# Altium schematic sheet MVM_PSU.SchDoc: Title
size 420 x 297 mm; Author: G.Kasprowicz; CompanyName: WUT ISE; DrawnBy: G.Kasprowicz; Organization: WUT ISE; Address1: PW ISE; Address2: Nowowiejska 15/19 00-665 Warsaw; Address3: gkasprow@gmail.com; Revision: 2; SheetNumber: -; SheetTotal: -; ModifiedBy: -; CheckedDate: -; Title2: Title 2; DivGrp: WUT ISE; Designer: G.Kasprowicz; ModifiedDate: -; ProjectName: Sensor Box
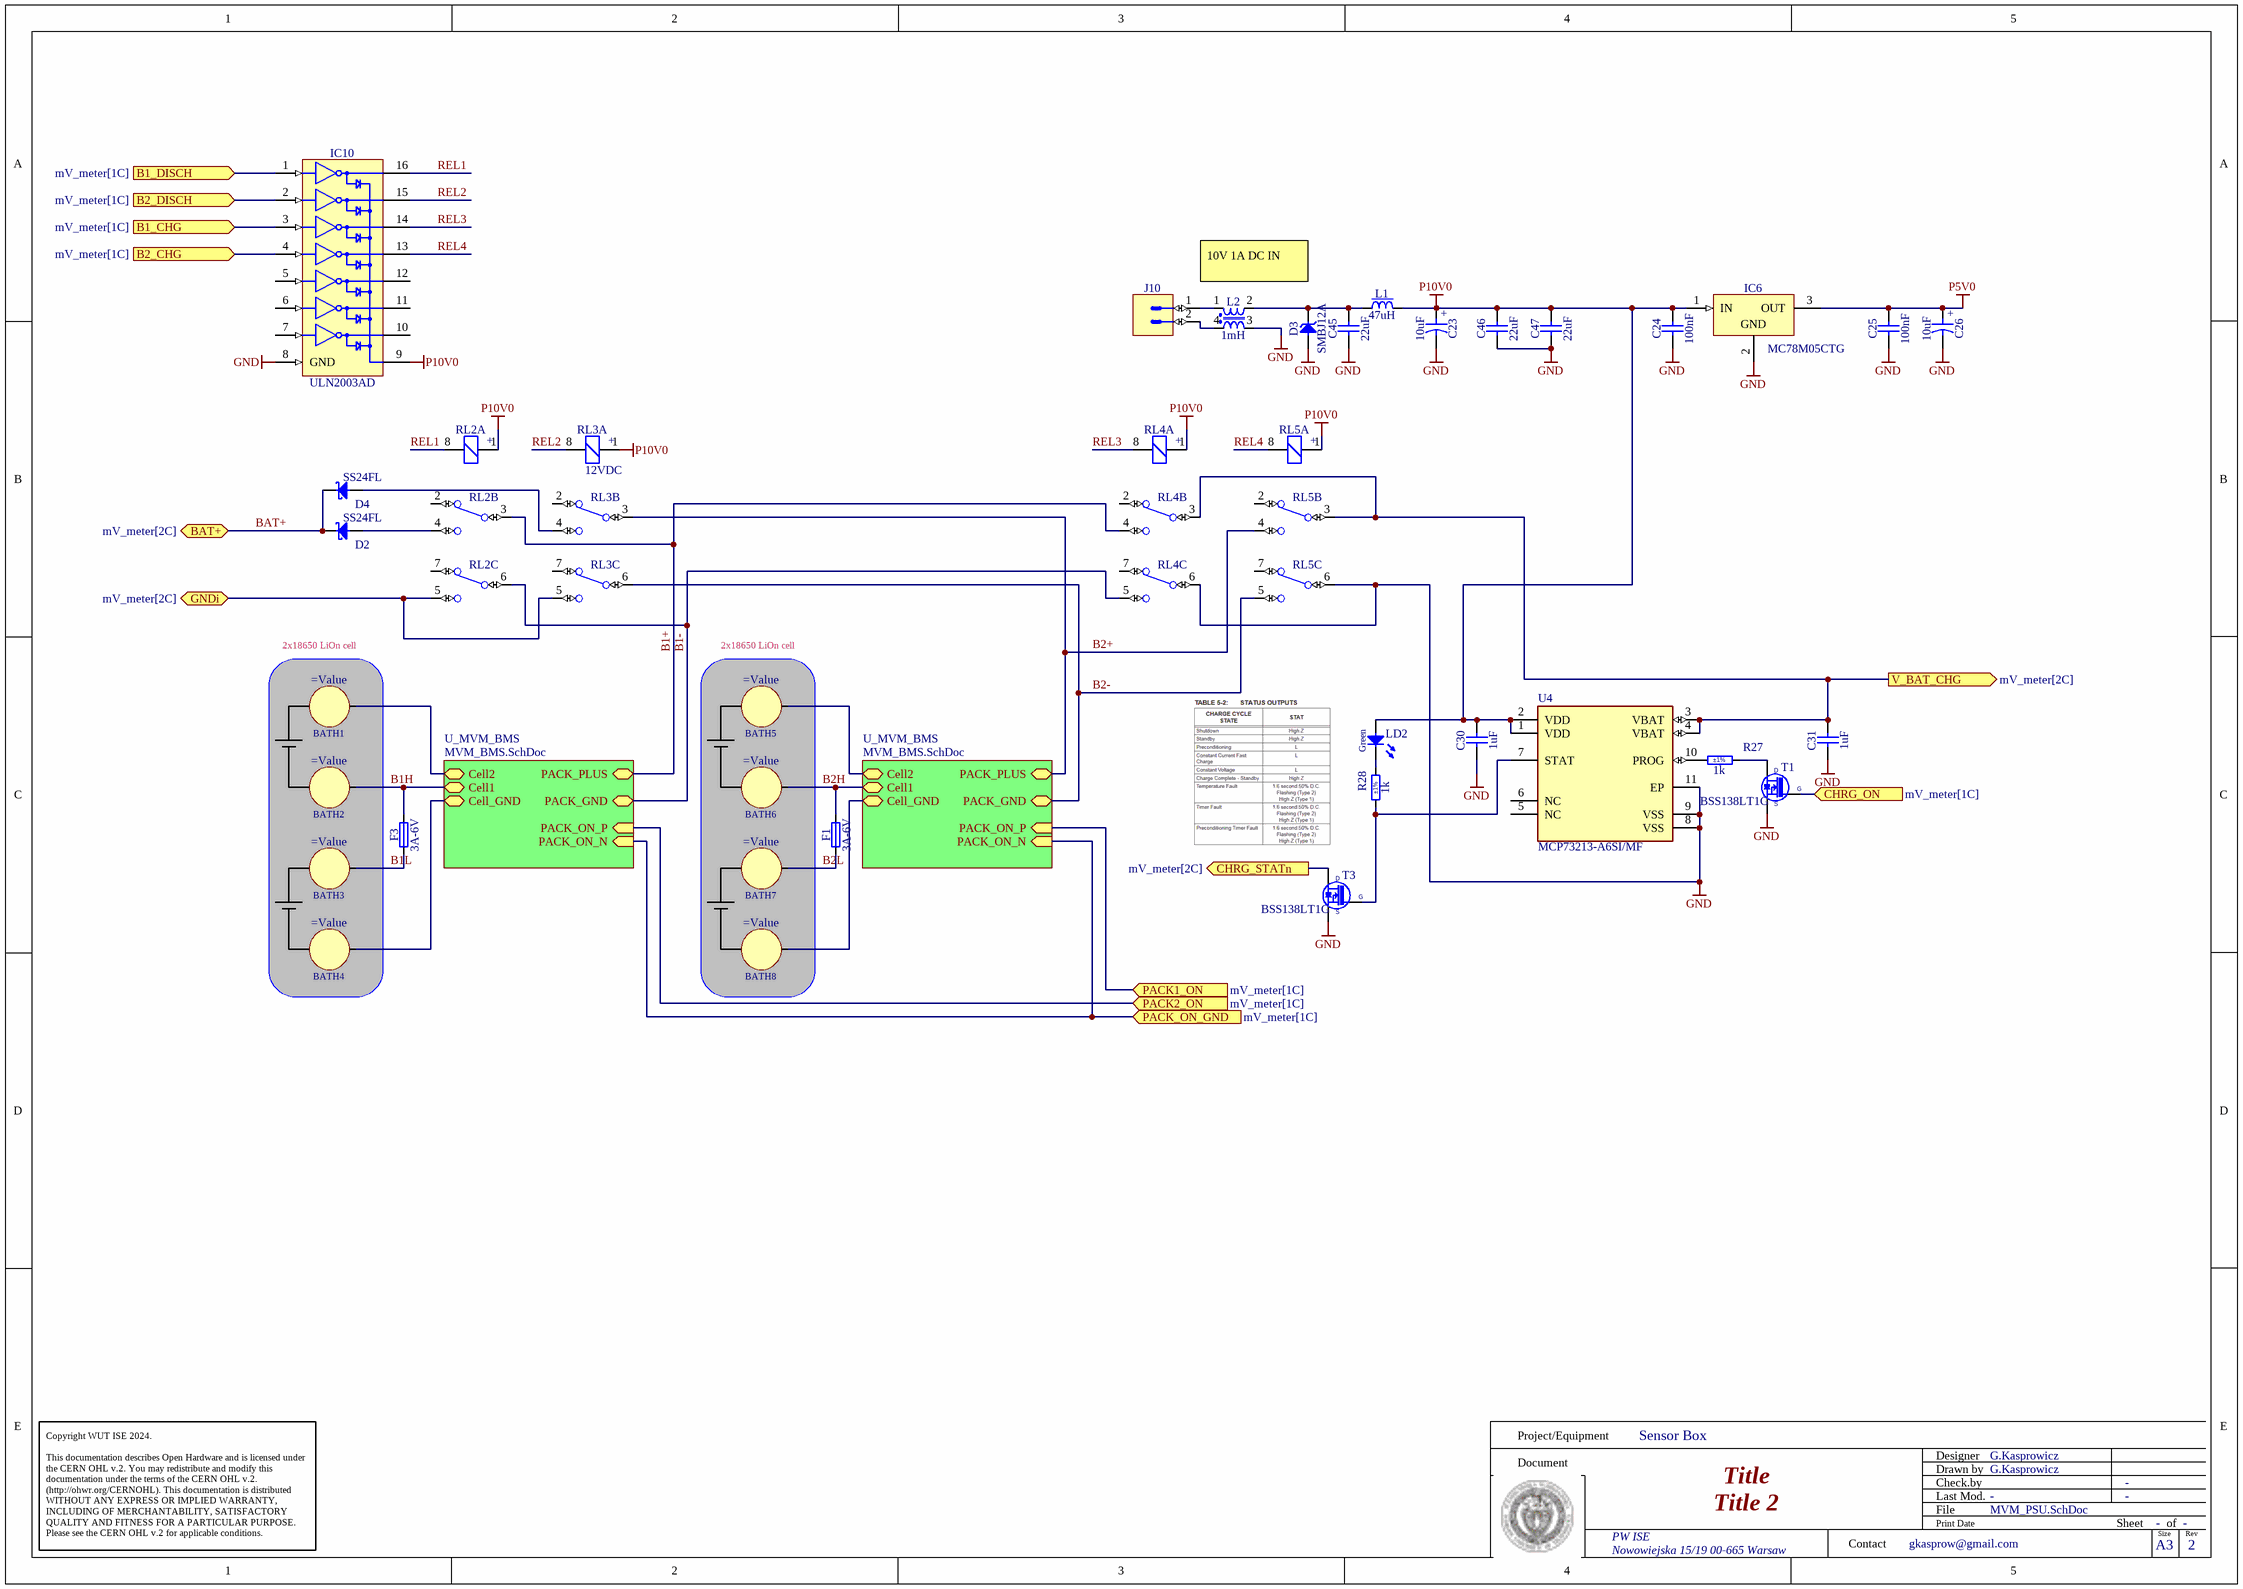
[diagram p0: MVM_PSU.SchDoc]

## Parts
BATH1  (no value)  [BATH_KEYSTONE_54]
BATH2  (no value)  [BATH_KEYSTONE_54]
BATH3  (no value)  [BATH_KEYSTONE_54]
BATH4  (no value)  [BATH_KEYSTONE_54]
BATH5  (no value)  [BATH_KEYSTONE_54]
BATH6  (no value)  [BATH_KEYSTONE_54]
BATH7  (no value)  [BATH_KEYSTONE_54]
BATH8  (no value)  [BATH_KEYSTONE_54]
C23  10uF  [CAPMP3216X180N]
C24  100nF  [CAPC2012X88N]
C25  100nF  [CAPC2012X88N]
C26  10uF  [CAPMP3216X180N]
C30  1uF  [CAPC1608X87N]
C31  1uF  [CAPC1608X87N]
C45  22uF  [CAPC3216X180N]
C46  22uF  [CAPC3216X180N]
C47  22uF  [CAPC3216X180N]
D2  SS24FL  [SODFL3617X108N]
D3  SMBJ12A  [DIOM5336X265N]
D4  SS24FL  [SODFL3617X108N]
F1  3A-6V  [FUSR_BOURNS_MF-SM300]
F3  3A-6V  [FUSR_BOURNS_MF-SM300]
IC6  MC78M05CTG  [TO-220-V]
IC10  ULN2003AD  [SOIC127P600X175-16N]
J10  (no value)  [PHOENIX_1803277]
L1  47uH  [IND_WURTH_WE-LHMI_7050]
L2  1mH  [IND_BOURNS_SRF1006]
LD2  Green  [LED_AVAGO_HSME-C110]
R27  1k  Tolerance: ±1%  [RESC1608X55N]
R28  1k  Tolerance: ±1%  [RESC1608X55N]
RL2  REL_TYCO_IM Non-latching  [REL_TYCO_IMXXXGX]  (value not drawn)  (parts A,B,C of 3)
RL3  value 12VDC  [REL_TYCO_IMXXXGX]  (hidden comment: REL_TYCO_IM Non-latching)  (parts A,B,C of 3)
RL4  REL_TYCO_IM Non-latching  [REL_TYCO_IMXXXGX]  (value not drawn)  (parts A,B,C of 3)
RL5  REL_TYCO_IM Non-latching  [REL_TYCO_IMXXXGX]  (value not drawn)  (parts A,B,C of 3)
T1  BSS138LT1G  [SOT95P240X110-3N]
T3  BSS138LT1G  [SOT95P240X110-3N]
U4  MCP73213-A6SI/MF  [FP-C04-063-IPC_B]

## Blocks framed on the sheet
2x18650 LiOn cell: BATH1-BATH4
2x18650 LiOn cell: BATH5-BATH8

## Sub-sheets
U_MVM_BMS = MVM_BMS.SchDoc: Cell1 (bidir), Cell2 (bidir), Cell_GND (bidir), PACK_GND (bidir), PACK_PLUS (bidir), PACK_ON_P (in), PACK_ON_N (in)
U_MVM_BMS = MVM_BMS.SchDoc: Cell1 (bidir), Cell2 (bidir), Cell_GND (bidir), PACK_GND (bidir), PACK_PLUS (bidir), PACK_ON_P (in), PACK_ON_N (in)

## Ports
B1_CHG (in, see mV_meter[1C]), B1_DISCH (in, see mV_meter[1C]), B2_CHG (in, see mV_meter[1C]), B2_DISCH (in, see mV_meter[1C]), BAT+ (bidir, see mV_meter[2C]), CHRG_ON (in, see mV_meter[1C]), CHRG_STATn (out, see mV_meter[2C]), GNDi (bidir, see mV_meter[2C]), PACK1_ON (in, see mV_meter[1C]), PACK2_ON (in, see mV_meter[1C]), PACK_ON_GND (in, see mV_meter[1C]), V_BAT_CHG (out, see mV_meter[2C])

## Nets
GND: C23.2 C24.1 C25.1 C26.2 C30.1 C31.1 C45.1 C46.1 C47.1 D3.2(A) IC6.2(GND) IC10.8(GND) L2.3 RL4.6(C) RL5.6(C) T1.2(S) T3.2(S) U4.8(VSS) U4.9(VSS) U4.11(EP)
P5V0: C25.2 C26.1 IC6.3(OUT)
P10V0: C23.1 C24.2 C30.2 C46.2 C47.2 IC6.1(IN) IC10.9(COM) L1.2 LD2.2(A) RL2.1 RL3.1 RL4.1 RL5.1 U4.1(VDD) U4.2(VDD)
B1+: RL2.3(C) RL4.4(NO) ; sheet U_MVM_BMS/PACK_PLUS
B1-: RL2.6(C) RL4.5(NO) ; sheet U_MVM_BMS/PACK_GND
B1_CHG: IC10.3(IN3) ; port B1_CHG
B1_DISCH: IC10.1(IN1) ; port B1_DISCH
B1H: BATH2.1(PLUS) F3.2 ; sheet U_MVM_BMS/Cell1
B1L: BATH3.1(PLUS) F3.1
B2+: RL3.3(C) RL5.4(NO) ; sheet U_MVM_BMS/PACK_PLUS
B2-: RL3.6(C) RL5.5(NO) ; sheet U_MVM_BMS/PACK_GND
B2_CHG: IC10.4(IN4) ; port B2_CHG
B2_DISCH: IC10.2(IN2) ; port B2_DISCH
B2H: BATH6.1(PLUS) F1.2 ; sheet U_MVM_BMS/Cell1
B2L: BATH7.1(PLUS) F1.1
BAT+: D2.1(C) D4.1(C) ; port BAT+
CHRG_ON: T1.1(G) ; port CHRG_ON
CHRG_STATn: T3.3(D) ; port CHRG_STATn
GNDi: RL2.5(NO) RL3.5(NO) ; port GNDi
PACK1_ON: port PACK1_ON, sheet U_MVM_BMS/PACK_ON_P
PACK2_ON: port PACK2_ON, sheet U_MVM_BMS/PACK_ON_P
PACK_ON_GND: port PACK_ON_GND, sheet U_MVM_BMS/PACK_ON_N, sheet U_MVM_BMS/PACK_ON_N
REL1: IC10.16(OUT1) RL2.8
REL2: IC10.15(OUT2) RL3.8
REL3: IC10.14(OUT3) RL4.8
REL4: IC10.13(OUT4) RL5.8
V_BAT_CHG: C31.2 RL4.3(C) RL5.3(C) U4.3(VBAT) U4.4(VBAT) ; port V_BAT_CHG
NetBATH1_1: BATH1.1(PLUS) ; sheet U_MVM_BMS/Cell2
NetBATH4_1: BATH4.1(PLUS) ; sheet U_MVM_BMS/Cell_GND
NetBATH5_1: BATH5.1(PLUS) ; sheet U_MVM_BMS/Cell2
NetBATH8_1: BATH8.1(PLUS) ; sheet U_MVM_BMS/Cell_GND
NetC45_2: C45.2 D3.1(C) L1.1 L2.2
NetD2_2: D2.2(A) RL2.4(NO)
NetD4_2: D4.2(A) RL3.4(NO)
NetJ10_1: J10.1 L2.1
NetJ10_2: J10.2 L2.4
NetLD2_1: LD2.1(C) R28.2
NetR27_1: R27.1 U4.10(PROG)
NetR27_2: R27.2 T1.3(D)
NetR28_1: R28.1 T3.1(G) U4.7(STAT)

Not connected (* = marked no-connect by the designer): IC10 5(IN5) 6(IN6) 7(IN7) 10(OUT7) 11(OUT6) 12(OUT5); RL2 2(NC) 7(NC); RL3 2(NC) 7(NC); RL4 2(NC) 7(NC); RL5 2(NC) 7(NC); U4 5(NC) 6(NC)

## Notes on the sheet
- 10V 1A DC IN
- Project/Equipment
- Document
- Designer
- Drawn by
- Check.by
- Copyright WUT ISE 2024.
  This documentation describes Open Hardware and is licensed under the CERN OHL v.2. You may redistribute and modify this documentation under the terms of the CERN OHL v.2. (http://ohwr.org/CERNOHL). This documentation is distributed WITHOUT ANY EXPRESS OR IMPLIED WARRANTY, INCLUDING OF MERCHANTABILITY, SATISFACTORY QUALITY AND FITNESS FOR A PARTICULAR PURPOSE. Please see the CERN OHL v.2 for applicable conditions.
- Contact
- File
- Last Mod.
- Print Date
- Sheet
- Size
- A3
- of
- Rev
- (in symbol CTE3216-18_10UF_10V_10%_LESR1800) +
- (in symbol REL_TYCO_IM06CGR, part A) +

## Library data of the parts
BATH1-BATH8 = BATH_KEYSTONE_54: Battery Holder whit 1 Pin; Part Description: Clip for 16mm - 19mm Diameter Battery; Manufacturer Part Number: 54; PressFit: No; Part Number: BATH_KEYSTONE_54; Component Kind: Standard; Component Type: Standard; Pin Count: 1; PackageDescription: Clip for 16mm - 19mm Diameter Battery; Family: Battery; Mounted: Yes; Socket: No; SMD: No; Sense: No; Manufacturer: KEYSTONE; ComponentHeight: 16.59mm; HelpURL: \\cern.ch\dfs\Applications\Altium\Datasheets\BATH_KEYSTONE_54.pdf; Author: CERN DEM JLC; CreateDate: 21.03.2018; LatestRevisionDate: 21.03.2018
C23 C26 = CTE3216-18_10UF_10V_10%_LESR1800: Polarised capacitor; Part Description: Low ESR 1R8 Solid Tantalum Chip Capacitor; Manufacturer: GENERIC; Manufacturer1 Part Number: TPSA106K010R1800; Voltage: 10V; Tolerance: ±10%; Part Number: CTE3216-18_10UF_10V_10%_LESR1800; Component Kind: Standard; Component Type: Standard; Pin Count: 2; Value: 10uF; Status: Preferred; Manufacturer Part Number: CTE3216-18_10UF_10V_10%_LESR1800; Case: A; Mounted: Yes; Socket: No; SMD: Yes; Sense: No; Manufacturer1 Example: AVX; Manufacturer1 ComponentHeight: 1.8mm; HelpURL: \\cern.ch\dfs\Applications\Altium\Datasheets\CTE-LESR_AVX_TPS.pdf; Author: CERN DEM JLC; CreateDate: 05.05.2008; LatestRevisionDate: 20.01.2009
C24 C25 = CC0805_100NF_50V_1%_NP0: Non-polarised capacitor; Part Description: SMD Multilayer Chip Ceramic Capacitor; Manufacturer: GENERIC; Manufacturer1 Part Number: 0805N103F500C; Voltage: 50V; TC: C0G/NP0; Tolerance: ±1%; Part Number: CC0805_100NF_50V_1%_NP0; Component Kind: Standard; Component Type: Standard; Footprint: CAPC2012X135N; Pin Count: 2; Value: 100nF; Status: Not Recommended; Manufacturer Part Number: CC0805_100NF_50V_1%_NP0; Case: 0805; Mounted: Yes; Socket: No; SMD: Yes; Sense: No; ComponentHeight: 1.35mm; Manufacturer1 Example: WALSIN TECHNOLOGY CORPORATION; Manufacturer1 ComponentHeight: 1.35mm; HelpURL: \\cern.ch\dfs\Applications\Altium\Datasheets\CC0805_WALSIN_0805.pdf; Author: CERN DEM HF; CreateDate: 28.08.2023; LatestRevisionDate: 28.08.2023
C30 C31 = CC0603_1UF_16V_10%_X7R: Non-polarised capacitor; Part Description: SMD Multilayer Chip Ceramic Capacitor; Manufacturer: GENERIC; Manufacturer1 Part Number: 223878615663; Voltage: 16V; TC: X7R; Tolerance: ±10%; Part Number: CC0603_1UF_16V_10%_X7R; Component Kind: Standard; Component Type: Standard; Pin Count: 2; Value: 1uF; Status: None; Manufacturer Part Number: CC0603_1UF_16V_10%_X7R; Case: 0603; Mounted: Yes; Socket: No; SMD: Yes; Sense: No; Manufacturer1 Example: YAGEO PHYCOMP; Manufacturer1 ComponentHeight: 0.9mm; HelpURL: \\cern.ch\dfs\Applications\Altium\Datasheets\CC0603_X7R_PHYCOMP.pdf; Author: CERN DEM JLC; CreateDate: 03.12.2007; LatestRevisionDate: 17.04.2015
C45-C47 = CC1206_22UF_10V_10%_X7R: Non-polarised capacitor; Part Description: SMD Multilayer Chip Ceramic Capacitor; Manufacturer: GENERIC; Manufacturer1 Part Number: GRM31CR71A226KE15L; Voltage: 10V; TC: X7R; Tolerance: ±10%; Part Number: CC1206_22UF_10V_10%_X7R; Component Kind: Standard; Component Type: Standard; Pin Count: 2; Value: 22uF; Status: Preferred; Manufacturer Part Number: CC1206_22UF_10V_10%_X7R; Case: 1206; Mounted: Yes; Socket: No; SMD: Yes; Sense: No; Manufacturer1 Example: MURATA; Manufacturer1 ComponentHeight: 1.8mm; HelpURL: \\cern.ch\dfs\Applications\Altium\Datasheets\CC1206_X7R_MURATA_GRM-HI-CAP.pdf; Author: CERN DEM JLC; CreateDate: 08.06.2010; LatestRevisionDate: 08.06.2010
D2 D4 = SS24FL: Schottky Diode; Part Description: Surface Mount Schottky Barrier Rectifier; Manufacturer: ON SEMICONDUCTOR; Voltage: 40V; Power: 2A; PressFit: No; Bonding: No; Part Number: SS24FL; Component Kind: Standard; Component Type: Standard; Device: SS24FL; PackageDescription: SODFL Diode (SOD123FL); 2.75mm W X 1.72mm L X 1.08mm H body, IPC Medium Density; Manufacturer Part Number: SS24FL; Pin Count: 2; Case: SOD-123FL; Mounted: Yes; Socket: No; SMD: Yes; Sense: No; ComponentHeight: 1.08mm; HelpURL: \\cern.ch\dfs\Applications\Altium\Datasheets\SS24FL.pdf; Author: CERN DEM BC; CreateDate: 06.10.2020; LatestRevisionDate: 06.10.2020
D3 = SMBJ12A: Zener Diode; Part Description: Uni-Directional Transient Voltage Suppressor Diode; Manufacturer: FAIRCHILD SEMICONDUCTOR; Voltage: 12V; Power: 600W; PressFit: No; Bonding: No; Part Number: SMBJ12A; Component Kind: Standard; Component Type: Standard; Device: SMBJ12A; PackageDescription: DO-214-AA/SMB Diode, Molded Body; 5.34mm L X 3.625mm W X 2.65mm H, IPC Medium Density; Manufacturer Part Number: SMBJ12A; Pin Count: 2; Case: DO-214AA; Mounted: Yes; Socket: No; SMD: Yes; Sense: No; ComponentHeight: 2.65mm; HelpURL: \\cern.ch\dfs\Applications\Altium\Datasheets\SMBJ.pdf; Author: CERN DEM JLC; CreateDate: 10.04.2013; LatestRevisionDate: 10.04.2013
F1 F3 = FUSR_BOURNS_MF-SM300-2: Fuse; Part Description: PTC Resettable Fuse; Manufacturer: BOURNS; PressFit: No; Part Number: FUSR_BOURNS_MF-SM300-2; Component Kind: Standard; Component Type: Standard; Pin Count: 2; PackageDescription: PolySwitch, 2-Leads, Body 7.35x5.12mm Nominal; Family: Fuses Resettable; Mounted: Yes; Socket: No; SMD: Yes; Sense: No; Value: 3A-6V; Manufacturer Part Number: MF-SM300-2; ComponentHeight: 3mm; HelpURL: \\cern.ch\dfs\Applications\Altium\Datasheets\FUSR_BOURNS_MF-SM300-2.pdf; Author: CERN DEM JLC; CreateDate: 15.08.2013; LatestRevisionDate: 15.08.2013
IC6 = MC78M05CTG_v: 3-Terminal Regulator 1=IN 2=GND 3=OUT; Part Description: 3-Terminal 5V 500mA Positive Voltage Regulator; Manufacturer: ON SEMICONDUCTOR; PressFit: No; Bonding: No; Part Number: MC78M05CTG_v; Component Kind: Standard; Component Type: Standard; Device: MC78M05CTG; PackageDescription: TO-220 3-Terminal - Vertical Mount; Manufacturer Part Number: MC78M05CT; Pin Count: 4; Case: TO-220; Mounted: Yes; Socket: No; SMD: No; Sense: No; ComponentHeight: 19.68mm; HelpURL: \\cern.ch\dfs\Applications\Altium\Datasheets\MC78M05CTG.pdf; Author: CERN DEM JLC; CreateDate: 08.03.2018; LatestRevisionDate: 24.05.2022
IC10 = ULN2003AD: High-Voltage High-Current Darlington Array; Manufacturer: TEXAS INSTRUMENTS; PressFit: No; Bonding: No; Part Number: ULN2003AD; Component Kind: Standard; Component Type: Standard; Device: ULN2003AD; PackageDescription: SOIC 16, Pitch 1.27mm - Body 4x10mm, IPC Medium Density; Part Description: High-Voltage High-Current Darlington Array; Manufacturer Part Number: ULN2003AD; Pin Count: 16; Case: SOIC16; Mounted: Yes; Socket: No; SMD: Yes; Sense: No; ComponentHeight: 1.75mm; Author: CERN DEM JLC; HelpURL: \\cern.ch\dfs\Applications\Altium\Datasheets\ULN2003AD.pdf; CreateDate: 04.08.2009; LatestRevisionDate: 04.08.2009
J10 = PHOENIX_1803277: Connector 2 Male; Part Description: 8A 160 V, Pitch: 3.81mm, 2 Positions  Right Angled Header; Manufacturer: PHOENIX CONTACT; Manufacturer Part Number: 1803277 (MC 1,5/ 2-G-3,81); PressFit: No; Part Number: PHOENIX_1803277; Component Kind: Standard; Component Type: Standard; Pin Count: 2; Mounted: Yes; Socket: No; SMD: No; Sense: No; Status: None; ComponentHeight: 7.25mm; HelpURL: \\cern.ch\dfs\Applications\Altium\Datasheets\PHOENIX_1803277.pdf; Author: CERN DEM JLC; CreateDate: 06.05.2014; LatestRevisionDate: 06.05.2014
L1 = IND_47UH_20%_WURTH_WE-LHMI_74437349470: Inductor With Core; Part Description: SMD Power Inductor (WE-LHMI Series); Manufacturer: WURTH ELEKTRONIK; Power: 1.45A; Resistance: 0.290R; Tolerance: ±20%; Part Number: IND_47UH_20%_WURTH_WE-LHMI_74437349470; Component Kind: Standard; Component Type: Standard; Pin Count: 2; Value: 47uH; Manufacturer Part Number: 74437349470; Mounted: Yes; Socket: No; SMD: Yes; Sense: No; ComponentHeight: 5mm; HelpURL: \\cern.ch\dfs\Applications\Altium\Datasheets\IND_WURTH_WE-LHMI_74437349470.pdf; Author: CERN DEM HF; CreateDate: 22.11.2023; LatestRevisionDate: 22.11.2023
L2 = IND_1MH_40%_BOURNS_SRF1006: Inductor Common Mode; Part Description: Line Filter, Common Mode Choke; Manufacturer: BOURNS; Manufacturer Part Number: SRF1006-102Y; Power: 0.95A; Resistance: 0.180R; Tolerance: ±40%; Part Number: IND_1MH_40%_BOURNS_SRF1006; Component Kind: Standard; Component Type: Standard; Pin Count: 2; Value: 1mH; Mounted: Yes; Socket: No; SMD: Yes; Sense: No; ComponentHeight: 6.5mm; HelpURL: \\cern.ch\dfs\Applications\Altium\Datasheets\IND_BOURNS_SRF1006.pdf; Author: CERN DEM HF; CreateDate: 30.01.2024; LatestRevisionDate: 30.01.2024
LD2 = LED_AVAGO_HSME-C110: LED Green 1C 2A; Part Description: High Performance Right Angle Chip Green LED; Manufacturer: AVAGO TECHNOLOGIES; PressFit: No; Bonding: No; Part Number: LED_AVAGO_HSME-C110; Component Kind: Standard; Component Type: Standard; Color: Green; PackageDescription: Green Chip LED, 2-Leads, Body 3.3x1.6mm, Side Emitting Package; Manufacturer Part Number: HSME-C110; Pin Count: 2; Case: 1206; Mounted: Yes; Socket: No; SMD: Yes; Sense: No; ComponentHeight: 1.1mm; HelpURL: \\cern.ch\dfs\Applications\Altium\Datasheets\LED_AVAGO_HSME-C110.pdf; ComponentLink1URL: \\cern.ch\dfs\Applications\Altium\Datasheets\LED_AVAGO_HSME-C110_DESIGN-GUIDE.pdf; ComponentLink1Description: Design Guide; Author: CERN DEM JMW; CreateDate: 30.07.2009; LatestRevisionDate: 20.06.2012
R27 R28 = R0603_1K_1%_0.1W_100PPM: Resistor - 1%; Part Description: General Purpose Thick Film Chip Resistor; Manufacturer: GENERIC; Manufacturer1 Part Number: NRC06F1001TRF; Power: 0.1W; TC: ±100ppm/°C; PressFit: No; Part Number: R0603_1K_1%_0.1W_100PPM; Component Kind: Standard; Component Type: Standard; Pin Count: 2; Value: 1k; Status: Preferred; Manufacturer Part Number: R0603_1K_1%_0.1W_100PPM; Case: 0603; Mounted: Yes; Sense: No; Socket: No; SMD: Yes; Manufacturer1 Example: NIC COMPONENT; Manufacturer1 ComponentHeight: 0.55mm; HelpURL: \\cern.ch\dfs\Applications\Altium\Datasheets\R0603_NIC_NRC.pdf; Author: CERN DEM JLC; CreateDate: 03.12.2007; LatestRevisionDate: 13.03.2008
RL2 RL4 RL5 = REL_TYCO_IM06CGR: IM Signal Relay (Monostable 1 Coil Non-latching); Part Description: 2A/250VAC, DPDT  (2 Form C) SMT High Dielectric Signal Relay, IM Series; Manufacturer: TYCO AXICOM; Manufacturer Part Number: IM06CGR or 9-1462037-9; PressFit: No; Value: 12VDC; Sense Comment: Cleaning Limitation; Status Comment: Sensitive (See Sensitive Field); Part Number: REL_TYCO_IM06CGR; Component Kind: Standard; Component Type: Standard; Pin Count: 8; PackageDescription: 8 Gull Wings Leads SMT Relay, IM Series, Body 10mm x 6mm; Mounted: Yes; Socket: No; SMD: Yes; Sense: Yes; Status: Not Recommended; ComponentHeight: 5.65mm; HelpURL: \\cern.ch\dfs\Applications\Altium\Datasheets\REL_TYCO_IM06CGR.pdf; Author: CERN DEM JLC; CreateDate: 04.12.2013; LatestRevisionDate: 04.12.2013
RL3 = REL_TYCO_IM06CGR: IM Signal Relay (Monostable 1 Coil Non-latching); Part Description: 2A/250VAC, DPDT  (2 Form C) SMT High Dielectric Signal Relay, IM Series; Manufacturer: TYCO AXICOM; Manufacturer Part Number: IM06CGR or 9-1462037-9; PressFit: No; Sense Comment: Cleaning Limitation; Status Comment: Sensitive (See Sensitive Field); Part Number: REL_TYCO_IM06CGR; Component Kind: Standard; Component Type: Standard; Pin Count: 8; PackageDescription: 8 Gull Wings Leads SMT Relay, IM Series, Body 10mm x 6mm; Mounted: Yes; Socket: No; SMD: Yes; Sense: Yes; Status: Not Recommended; ComponentHeight: 5.65mm; HelpURL: \\cern.ch\dfs\Applications\Altium\Datasheets\REL_TYCO_IM06CGR.pdf; Author: CERN DEM JLC; CreateDate: 04.12.2013; LatestRevisionDate: 04.12.2013
T1 T3 = BSS138LT1G: N-CHANNEL MOSFET WITH DIODE; Part Description: 50V, 200mA N-Channel Enhancement Mode Field-Effect Transistor; Manufacturer: ON SEMICONDUCTOR; PressFit: No; Bonding: No; Part Number: BSS138LT1G; Component Kind: Standard; Component Type: Standard; Device: BSS138LT1G; PackageDescription: SOT23, 0.95mm Pitch; 3 Pin, 1.40mm W X 3.00mm L X 1.10mm H body, IPC Medium Density; Manufacturer Part Number: BSS138L; Pin Count: 3; Case: SOT23-3; Mounted: Yes; Socket: No; SMD: Yes; Sense: No; ComponentHeight: 1.11mm; HelpURL: \\cern.ch\dfs\Applications\Altium\Datasheets\BSS138LT1G.pdf; Author: CERN DEM JLC; CreateDate: 23.03.2009; LatestRevisionDate: 25.05.2022
U4 = CMP-0133-00131-2: IC LI-ION/LI-POLY CTRLR 10-DFN; Number of Cells: 2; Max Input Voltage: 18V; Output Voltage: 8.4V; Max Supply Voltage: 13V; Operating Supply Current: 700uA; Drain to Source Resistance: 350mR; Max Output Current: 1.1A; Min Output Voltage: 8.15V; Voltage Rating: 8.85V; Min Supply Voltage: 4.2V; Radiation Hardening: No; Max Operating Temperature: 85°C; Mount: Surface Mount; Height: 0.037inch; REACH SVHC: No SVHC; Max Charge Current: 1.1A; Packaging: Rail/Tube; Number of Pins: 10; Package Quantity: 120; Case/Package: DFN; Max Output Voltage: 8.85V; Min Operating Temperature: -40°C; Length: 0.118inch; Number of Channels: 2; Width: 0.118inch; Lead Free: Lead Free